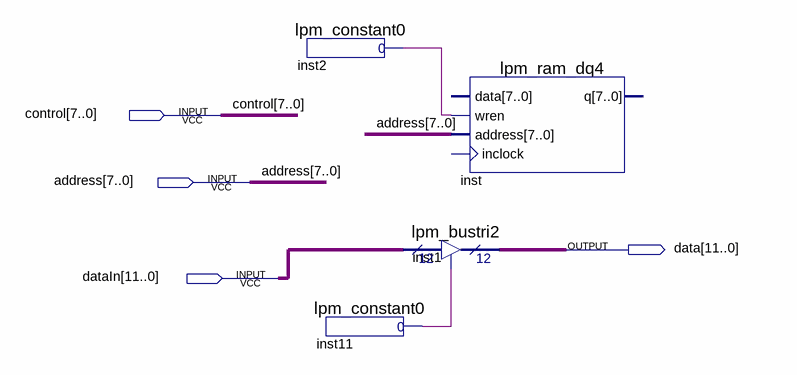
[diagram p0: schematic sheet]
// Quartus schematic RAM_block.bdf as structural Verilog: 4 symbols, 4 pins
module RAM_block (
  input  [7:0] control,
  input  [7:0] address,
  input  [11:0] dataIn,
  output [11:0] data
);

  wire inst2_result, inst11_result;

  lpm_constant0 inst2 (.result(inst2_result));
  lpm_constant0 inst11 (.result(inst11_result));
  lpm_ram_dq4 inst (.wren(inst2_result), .address(address));  // open: data, inclock, q
  lpm_bustri2 inst1 (.enabledt(inst11_result), .data(dataIn), .tridata(data));
endmodule
